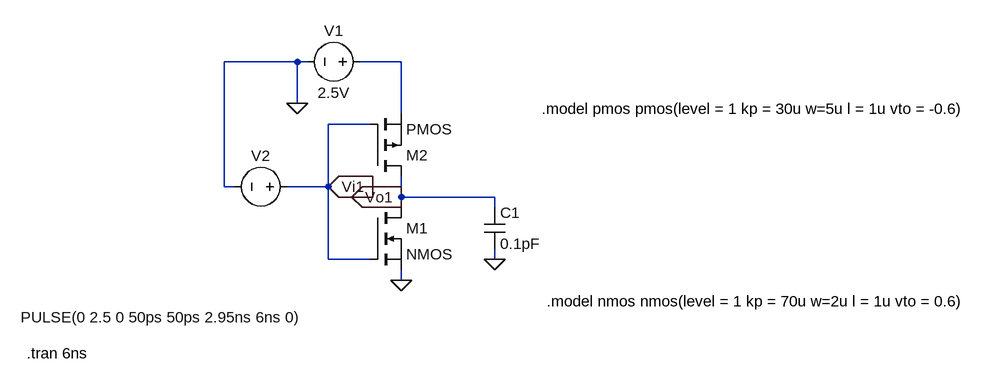
[diagram p0: schematic Draft2.asc]
Draft2.asc, the LTspice schematic file:
Version 4
SHEET 1 1148 680
WIRE 0 -96 -112 -96
WIRE 16 -96 0 -96
WIRE 160 -96 96 -96
WIRE 0 -32 0 -96
WIRE 160 -16 160 -96
WIRE 112 0 48 0
WIRE -112 96 -112 -96
WIRE -96 96 -112 96
WIRE 48 96 48 0
WIRE 48 96 -16 96
WIRE 160 112 160 80
WIRE 304 112 160 112
WIRE 160 128 160 112
WIRE 304 128 304 112
WIRE 48 208 48 96
WIRE 112 208 48 208
WIRE 304 208 304 192
WIRE 160 240 160 224
FLAG 160 240 0
FLAG 0 -32 0
FLAG 48 96 Vi1
IOPIN 48 96 In
FLAG 160 112 Vo1
IOPIN 160 112 Out
FLAG 304 208 0
SYMBOL nmos 112 128 R0
SYMATTR InstName M1
SYMBOL pmos 112 80 M180
SYMATTR InstName M2
SYMBOL voltage 112 -96 R90
WINDOW 0 -32 56 VBottom 2
WINDOW 3 32 56 VTop 2
SYMATTR InstName V1
SYMATTR Value 2.5V
SYMBOL voltage 0 96 R90
WINDOW 0 -32 56 VBottom 2
WINDOW 3 185 209 VTop 2
WINDOW 123 0 0 Left 2
WINDOW 39 0 0 Left 2
SYMATTR InstName V2
SYMATTR Value PULSE(0 2.5 0 50ps 50ps 2.95ns 6ns 0)
SYMBOL cap 288 128 R0
SYMATTR InstName C1
SYMATTR Value 0.1pF
TEXT 384 272 Left 2 !.model nmos nmos(level = 1 kp = 70u w=2u l = 1u vto = 0.6)
TEXT 376 -24 Left 2 !.model pmos pmos(level = 1 kp = 30u w=5u l = 1u vto = -0.6)
TEXT -416 352 Left 2 !.tran 6ns

The netlist it stands for:
* Draft2.asc
M1 Vo1 Vi1 0 0 NMOS
M2 Vo1 Vi1 N001 N001 PMOS
V1 N001 0 2.5V
V2 Vi1 0 PULSE(0 2.5 0 50ps 50ps 2.95ns 6ns 0)
C1 Vo1 0 0.1pF
.model NMOS NMOS
.model PMOS PMOS
.lib standard.mos
.model nmos nmos(level = 1 kp = 70u w=2u l = 1u vto = 0.6)
.model pmos pmos(level = 1 kp = 30u w=5u l = 1u vto = -0.6)
.tran 6ns
.backanno
.end

* Results of the author's LTspice run, read from the files saved beside the schematic
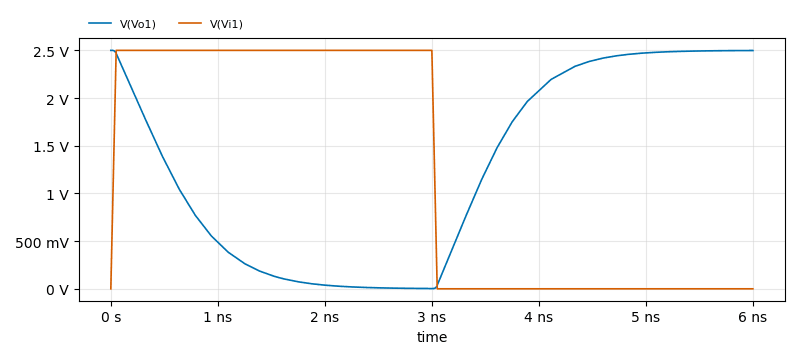
[diagram p1: Transient Analysis of Draft2.asc, plotted from the saved traces]
* Transient Analysis, 1 run:
*   V(Vo1): min 2.653 mV, max 2.5 V, average 1.267 V, rms 1.632 V, last 2.498 V
*   V(Vi1): min 0 V, max 2.5 V, average 1.25 V, rms 1.763 V, last 0 V